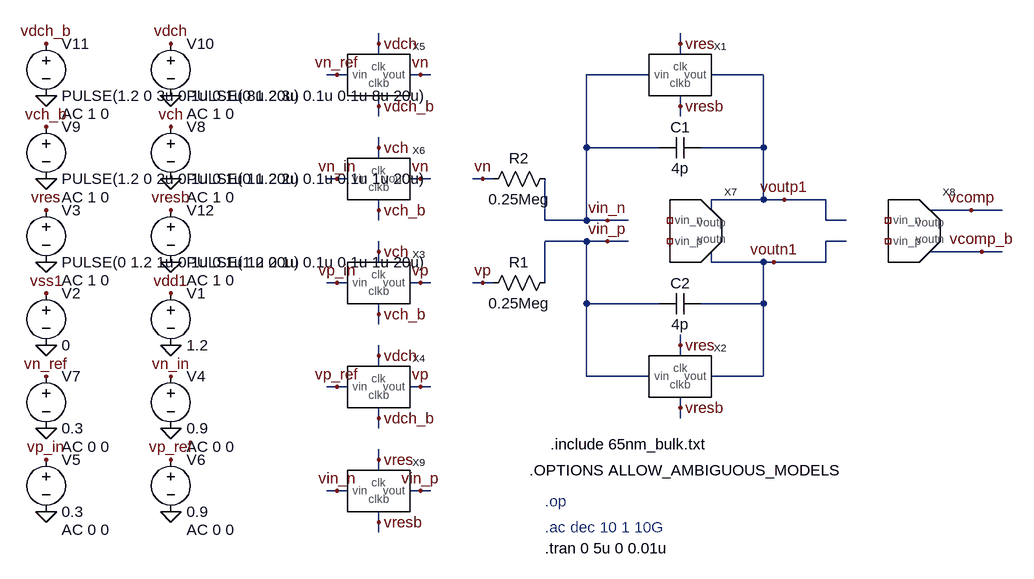
[diagram p0: schematic ADC_DS_CT_FAST.asc]
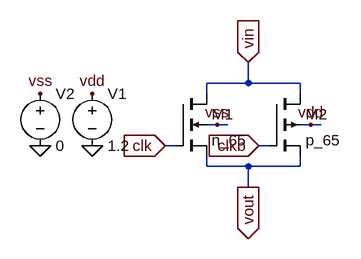
[diagram p1: sub-circuit tg_switch.asc]
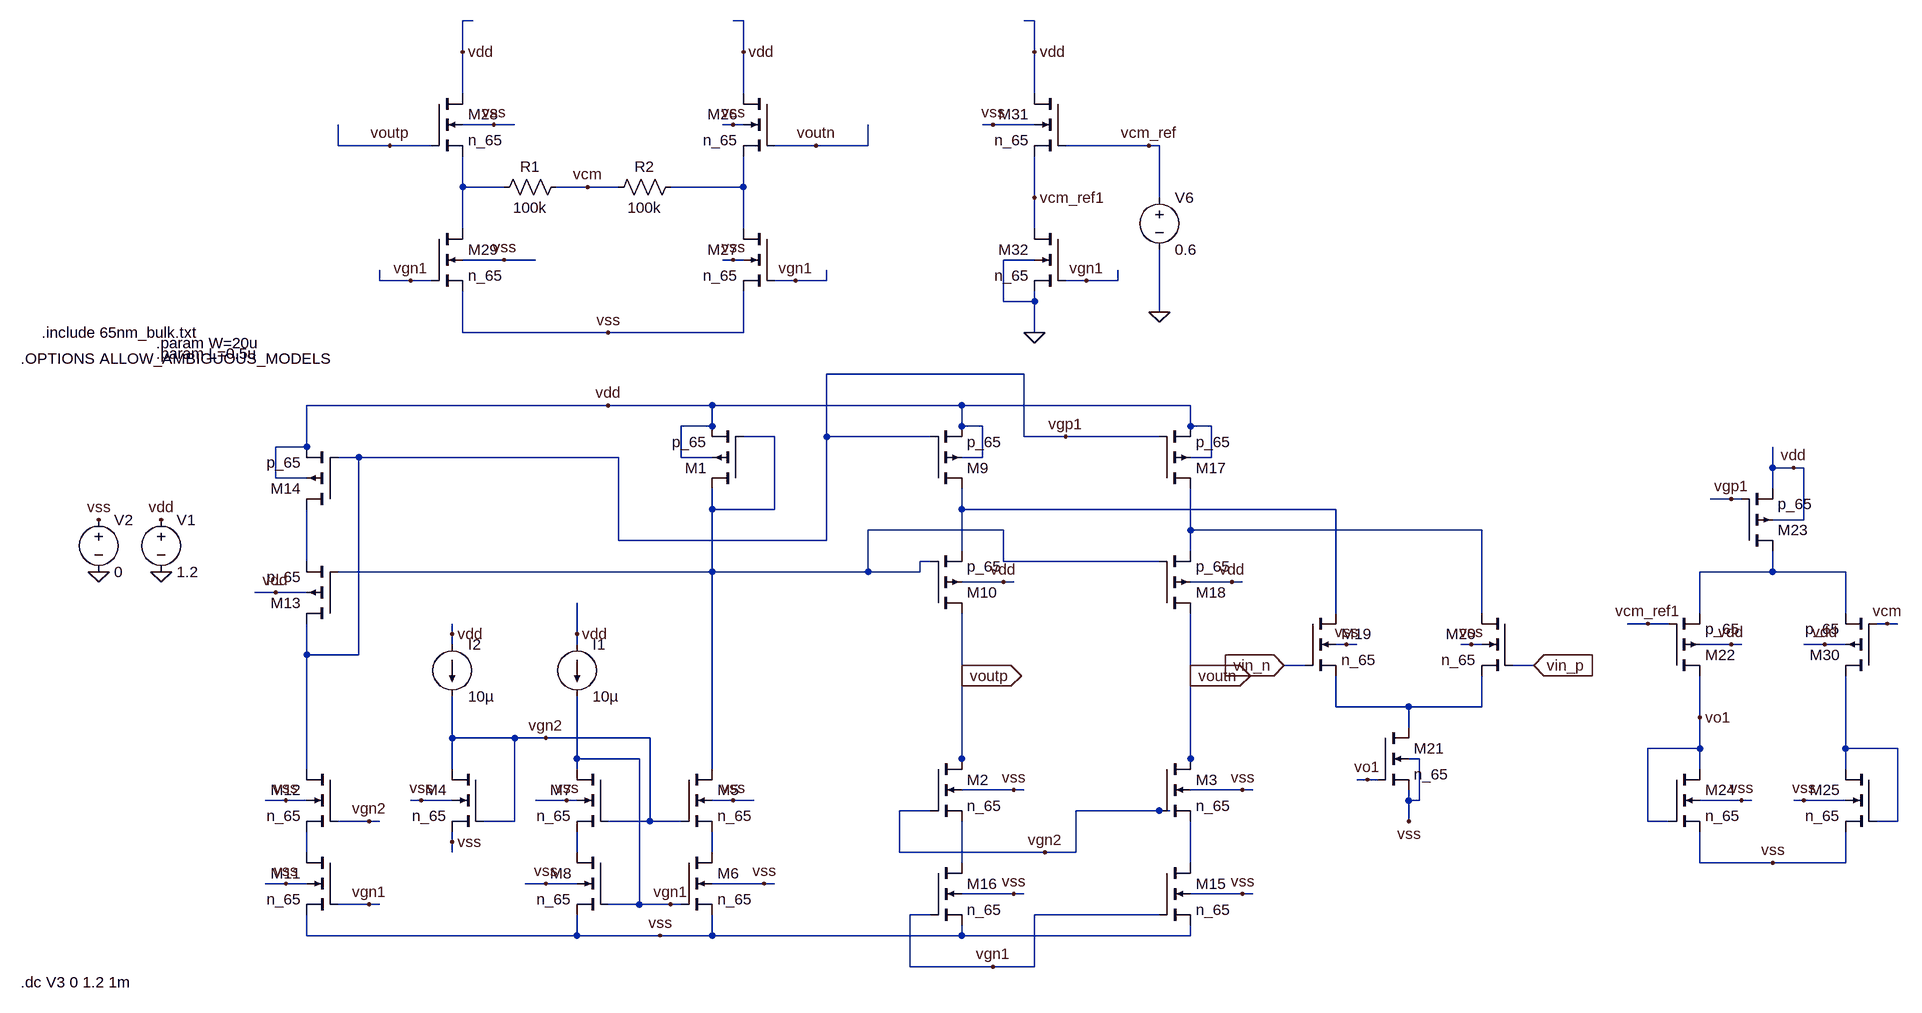
[diagram p2: sub-circuit fc_ota_small_input.asc]
ADC_DS_CT_FAST.asc, the LTspice schematic file:
Version 4.1
SHEET 1 1620 1140
WIRE 464 -176 464 -192
WIRE 928 -176 928 -192
WIRE 464 -160 464 -176
WIRE 928 -160 928 -176
WIRE 400 -128 384 -128
WIRE 416 -128 400 -128
WIRE 528 -128 512 -128
WIRE 544 -128 528 -128
WIRE 880 -128 784 -128
WIRE 1056 -128 976 -128
WIRE 464 -80 464 -96
WIRE 928 -80 928 -96
WIRE 464 -64 464 -80
WIRE 928 -64 928 -80
WIRE 464 -16 464 -32
WIRE 784 -16 784 -128
WIRE 896 -16 784 -16
WIRE 1056 -16 1056 -128
WIRE 1056 -16 960 -16
WIRE 464 0 464 -16
WIRE 400 32 384 32
WIRE 416 32 400 32
WIRE 528 32 512 32
WIRE 544 32 528 32
WIRE 624 32 608 32
WIRE 640 32 624 32
WIRE 1056 64 1056 -16
WIRE 1056 64 976 64
WIRE 1088 64 1056 64
WIRE 1152 64 1088 64
WIRE 464 80 464 64
WIRE 976 80 976 64
WIRE 1376 80 1312 80
WIRE 1424 80 1376 80
WIRE 464 96 464 80
WIRE 720 96 720 32
WIRE 784 96 784 -16
WIRE 784 96 720 96
WIRE 816 96 784 96
WIRE 848 96 816 96
WIRE 1152 96 1152 64
WIRE 1184 96 1152 96
WIRE 784 128 720 128
WIRE 816 128 784 128
WIRE 848 128 816 128
WIRE 1184 128 1152 128
WIRE 464 144 464 128
WIRE 1392 144 1312 144
WIRE 1424 144 1392 144
WIRE 464 160 464 144
WIRE 976 160 976 144
WIRE 1056 160 976 160
WIRE 1072 160 1056 160
WIRE 1152 160 1152 128
WIRE 1152 160 1072 160
WIRE 400 192 384 192
WIRE 416 192 400 192
WIRE 528 192 512 192
WIRE 544 192 528 192
WIRE 624 192 608 192
WIRE 640 192 624 192
WIRE 720 192 720 128
WIRE 784 224 784 128
WIRE 896 224 784 224
WIRE 1056 224 1056 160
WIRE 1056 224 960 224
WIRE 464 240 464 224
WIRE 464 256 464 240
WIRE 928 288 928 272
WIRE 464 304 464 288
WIRE 928 304 928 288
WIRE 464 320 464 304
WIRE 784 336 784 224
WIRE 880 336 784 336
WIRE 1056 336 1056 224
WIRE 1056 336 976 336
WIRE 400 352 384 352
WIRE 416 352 400 352
WIRE 528 352 512 352
WIRE 544 352 528 352
WIRE 928 384 928 368
WIRE 464 400 464 384
WIRE 928 400 928 384
WIRE 464 416 464 400
WIRE 464 464 464 448
WIRE 464 480 464 464
WIRE 400 512 384 512
WIRE 416 512 400 512
WIRE 528 512 512 512
WIRE 544 512 528 512
WIRE 464 560 464 544
WIRE 464 576 464 560
FLAG 144 288 0
FLAG 144 208 vdd1
FLAG -48 288 0
FLAG -48 208 vss1
FLAG 1088 64 voutp1
FLAG 1072 160 voutn1
FLAG -48 160 0
FLAG -48 80 vres
FLAG 928 -176 vres
FLAG 928 -80 vresb
FLAG 928 288 vres
FLAG 928 384 vresb
FLAG 144 416 0
FLAG -48 544 0
FLAG -48 464 vp_in
FLAG 144 336 vn_in
FLAG 624 32 vn
FLAG 624 192 vp
FLAG 464 144 vch
FLAG 464 240 vch_b
FLAG 464 304 vdch
FLAG 464 400 vdch_b
FLAG 528 352 vp
FLAG 528 192 vp
FLAG 144 544 0
FLAG 144 464 vp_ref
FLAG -48 416 0
FLAG -48 336 vn_ref
FLAG 464 -176 vdch
FLAG 464 -80 vdch_b
FLAG 528 -128 vn
FLAG 464 -16 vch
FLAG 464 80 vch_b
FLAG 528 32 vn
FLAG 400 32 vn_in
FLAG 400 -128 vn_ref
FLAG 400 192 vp_in
FLAG 400 352 vp_ref
FLAG 144 32 0
FLAG 144 -48 vch
FLAG -48 32 0
FLAG -48 -48 vch_b
FLAG 144 -96 0
FLAG 144 -176 vdch
FLAG -48 -96 0
FLAG -48 -176 vdch_b
FLAG 144 160 0
FLAG 144 80 vresb
FLAG 1376 80 vcomp
FLAG 1392 144 vcomp_b
FLAG 464 464 vres
FLAG 464 560 vresb
FLAG 816 96 vin_n
FLAG 400 512 vin_n
FLAG 528 512 vin_p
FLAG 816 128 vin_p
DATAFLAG 784 48 ""
DATAFLAG 784 192 ""
DATAFLAG 752 96 ""
DATAFLAG 752 128 ""
SYMBOL voltage 144 192 R0
WINDOW 123 0 0 Left 0
WINDOW 39 0 0 Left 0
SYMATTR InstName V1
SYMATTR Value 1.2
SYMBOL voltage -48 192 R0
WINDOW 123 0 0 Left 0
WINDOW 39 0 0 Left 0
SYMATTR InstName V2
SYMATTR Value 0
SYMBOL voltage -48 64 R0
WINDOW 123 24 124 Left 2
WINDOW 39 0 0 Left 0
SYMATTR Value2 AC 1 0
SYMATTR InstName V3
SYMATTR Value PULSE(0 1.2 1u 0.1u 0.1u 1u 20u)
SYMBOL cap 960 -32 R90
WINDOW 0 0 32 VBottom 2
WINDOW 3 32 32 VTop 2
SYMATTR InstName C1
SYMATTR Value 4p
SYMBOL cap 960 208 R90
WINDOW 0 0 32 VBottom 2
WINDOW 3 32 32 VTop 2
SYMATTR InstName C2
SYMATTR Value 4p
SYMBOL res 736 176 R90
WINDOW 0 0 56 VBottom 2
WINDOW 3 32 56 VTop 2
SYMATTR InstName R1
SYMATTR Value 0.25Meg
SYMBOL res 736 16 R90
WINDOW 0 0 56 VBottom 2
WINDOW 3 32 56 VTop 2
SYMATTR InstName R2
SYMATTR Value 0.25Meg
SYMBOL TG_Switch 928 -128 R0
SYMATTR InstName X1
SYMBOL TG_Switch 928 336 R0
SYMATTR InstName X2
SYMBOL voltage 144 320 R0
WINDOW 123 24 124 Left 2
WINDOW 39 0 0 Left 0
SYMATTR Value2 AC 0 0
SYMATTR InstName V4
SYMATTR Value 0.9
SYMBOL voltage -48 448 R0
WINDOW 123 24 124 Left 2
WINDOW 39 0 0 Left 0
SYMATTR Value2 AC 0 0
SYMATTR InstName V5
SYMATTR Value 0.3
SYMBOL TG_Switch 464 192 R0
SYMATTR InstName X3
SYMBOL TG_Switch 464 352 R0
SYMATTR InstName X4
SYMBOL voltage 144 448 R0
WINDOW 123 24 124 Left 2
WINDOW 39 0 0 Left 0
SYMATTR Value2 AC 0 0
SYMATTR InstName V6
SYMATTR Value 0.9
SYMBOL voltage -48 320 R0
WINDOW 123 24 124 Left 2
WINDOW 39 0 0 Left 0
SYMATTR Value2 AC 0 0
SYMATTR InstName V7
SYMATTR Value 0.3
SYMBOL TG_Switch 464 -128 R0
SYMATTR InstName X5
SYMBOL TG_Switch 464 32 R0
SYMATTR InstName X6
SYMBOL voltage 144 -64 R0
WINDOW 123 24 124 Left 2
WINDOW 39 0 0 Left 0
SYMATTR Value2 AC 1 0
SYMATTR InstName V8
SYMATTR Value PULSE(0 1.2 2u 0.1u 0.1u 1u 20u)
SYMBOL voltage 144 -192 R0
WINDOW 123 24 124 Left 2
WINDOW 39 0 0 Left 0
SYMATTR Value2 AC 1 0
SYMATTR InstName V10
SYMATTR Value PULSE(0 1.2 3u 0.1u 0.1u 8u 20u)
SYMBOL voltage -48 -192 R0
WINDOW 123 24 124 Left 2
WINDOW 39 0 0 Left 0
SYMATTR Value2 AC 1 0
SYMATTR InstName V11
SYMATTR Value PULSE(1.2 0 3u 0.1u 0.1u 8u 20u)
SYMBOL FC_OTA_small_input 944 112 R0
SYMATTR InstName X7
SYMBOL voltage 144 64 R0
WINDOW 123 24 124 Left 2
WINDOW 39 0 0 Left 0
SYMATTR Value2 AC 1 0
SYMATTR InstName V12
SYMATTR Value PULSE(1.2 0 1u 0.1u 0.1u 1u 20u)
SYMBOL voltage -48 -64 R0
WINDOW 123 24 124 Left 2
WINDOW 39 0 0 Left 0
SYMATTR Value2 AC 1 0
SYMATTR InstName V9
SYMATTR Value PULSE(1.2 0 2u 0.1u 0.1u 1u 20u)
SYMBOL FC_OTA_small_input 1280 112 R0
SYMATTR InstName X8
SYMBOL TG_Switch 464 512 R0
SYMATTR InstName X9
TEXT 728 440 Left 2 !.include 65nm_bulk.txt
TEXT 696 480 Left 2 !.OPTIONS ALLOW_AMBIGUOUS_MODELS
TEXT 720 528 Left 2 ;.op
TEXT 720 568 Left 2 ;.ac dec 10 1 10G
TEXT 720 600 Left 2 !.tran 0 5u 0 0.01u

tg_switch.asc, the sub-circuit schematic file:
Version 4.1
SHEET 1 880 680
WIRE 112 0 112 -32
WIRE 112 0 48 0
WIRE 192 0 112 0
WIRE 48 16 48 0
WIRE 192 16 192 0
WIRE 64 64 48 64
WIRE 80 64 64 64
WIRE 208 64 192 64
WIRE 224 64 208 64
WIRE 0 96 -16 96
WIRE 144 96 128 96
WIRE 48 128 48 112
WIRE 112 128 48 128
WIRE 192 128 192 112
WIRE 192 128 112 128
WIRE 112 160 112 128
FLAG 64 64 vss
FLAG 208 64 vdd
FLAG -16 96 clk
IOPIN -16 96 In
FLAG 128 96 clkb
IOPIN 128 96 In
FLAG 112 -32 vin
IOPIN 112 -32 In
FLAG -128 96 0
FLAG -128 16 vdd
FLAG -208 96 0
FLAG -208 16 vss
FLAG 112 160 vout
IOPIN 112 160 Out
SYMBOL nmos4 0 16 R0
SYMATTR InstName M1
SYMATTR Value n_65
SYMATTR Value2 l=1u w=1u
SYMBOL pmos4 144 16 R0
SYMATTR InstName M2
SYMATTR Value p_65
SYMATTR Value2 l=1u w=2u
SYMBOL voltage -128 0 R0
WINDOW 123 0 0 Left 0
WINDOW 39 0 0 Left 0
SYMATTR InstName V1
SYMATTR Value 1.2
SYMBOL voltage -208 0 R0
WINDOW 123 0 0 Left 0
WINDOW 39 0 0 Left 0
SYMATTR InstName V2
SYMATTR Value 0

fc_ota_small_input.asc, the sub-circuit schematic file:
Version 4.1
SHEET 1 1988 876
WIRE -752 -816 -768 -816
WIRE -336 -816 -352 -816
WIRE 112 -816 96 -816
WIRE -768 -768 -768 -816
WIRE -336 -768 -336 -816
WIRE 112 -768 112 -816
WIRE -768 -704 -768 -768
WIRE -336 -704 -336 -768
WIRE 112 -704 112 -768
WIRE -720 -656 -768 -656
WIRE -688 -656 -720 -656
WIRE -352 -656 -368 -656
WIRE -336 -656 -352 -656
WIRE 48 -656 32 -656
WIRE 112 -656 48 -656
WIRE -960 -624 -960 -656
WIRE -880 -624 -960 -624
WIRE -816 -624 -880 -624
WIRE -224 -624 -288 -624
WIRE -144 -624 -144 -656
WIRE -144 -624 -224 -624
WIRE 288 -624 160 -624
WIRE 304 -624 288 -624
WIRE -768 -560 -768 -608
WIRE -704 -560 -768 -560
WIRE -576 -560 -624 -560
WIRE -528 -560 -576 -560
WIRE -336 -560 -336 -608
WIRE -336 -560 -448 -560
WIRE 112 -544 112 -608
WIRE 304 -544 304 -624
WIRE -768 -496 -768 -560
WIRE -336 -496 -336 -560
WIRE 112 -496 112 -544
WIRE -704 -448 -768 -448
WIRE -656 -448 -704 -448
WIRE -352 -448 -368 -448
WIRE -336 -448 -352 -448
WIRE 112 -448 64 -448
WIRE -896 -416 -896 -432
WIRE -848 -416 -896 -416
WIRE -816 -416 -848 -416
WIRE -256 -416 -288 -416
WIRE -208 -416 -208 -432
WIRE -208 -416 -256 -416
WIRE 192 -416 160 -416
WIRE 240 -416 240 -432
WIRE 240 -416 192 -416
WIRE 64 -384 64 -448
WIRE 112 -384 112 -400
WIRE 112 -384 64 -384
WIRE 304 -368 304 -464
WIRE -768 -336 -768 -400
WIRE -544 -336 -768 -336
WIRE -336 -336 -336 -400
WIRE -336 -336 -544 -336
WIRE 112 -336 112 -384
WIRE 96 -272 -208 -272
WIRE -544 -224 -1008 -224
WIRE -384 -224 -544 -224
WIRE 0 -224 -384 -224
WIRE 352 -224 0 -224
WIRE -384 -192 -384 -224
WIRE -384 -192 -432 -192
WIRE 0 -192 0 -224
WIRE 32 -192 0 -192
WIRE 352 -192 352 -224
WIRE 384 -192 352 -192
WIRE -288 -176 -336 -176
WIRE -208 -176 -208 -272
WIRE -48 -176 -208 -176
WIRE 96 -176 96 -272
WIRE 160 -176 96 -176
WIRE 304 -176 160 -176
WIRE -1008 -160 -1008 -224
WIRE -1008 -160 -1056 -160
WIRE -1008 -144 -1008 -160
WIRE -928 -144 -960 -144
WIRE -528 -144 -928 -144
WIRE -432 -144 -432 -192
WIRE -384 -144 -432 -144
WIRE 32 -144 32 -192
WIRE 32 -144 0 -144
WIRE 384 -144 384 -192
WIRE 384 -144 352 -144
WIRE 1248 -128 1248 -160
WIRE 1280 -128 1248 -128
WIRE 1296 -128 1280 -128
WIRE -1056 -112 -1056 -160
WIRE -1008 -112 -1056 -112
WIRE 1248 -96 1248 -128
WIRE 1184 -80 1152 -80
WIRE 1200 -80 1184 -80
WIRE -384 -64 -384 -96
WIRE -288 -64 -288 -176
WIRE -288 -64 -384 -64
WIRE 0 -64 0 -96
WIRE 576 -64 0 -64
WIRE 1296 -48 1296 -128
WIRE 1296 -48 1248 -48
WIRE 64 -32 -144 -32
WIRE 352 -32 352 -96
WIRE 800 -32 352 -32
WIRE -528 -16 -528 -144
WIRE -208 -16 -208 -176
WIRE -208 -16 -528 -16
WIRE 0 0 0 -64
WIRE 352 0 352 -32
WIRE -1008 16 -1008 -64
WIRE -48 16 -64 16
WIRE 64 16 64 -32
WIRE 304 16 64 16
WIRE -384 32 -384 -64
WIRE -384 32 -960 32
WIRE -144 32 -144 -32
WIRE -144 32 -384 32
WIRE -64 32 -64 16
WIRE -64 32 -144 32
WIRE 1248 32 1248 0
WIRE 1248 32 1136 32
WIRE 1360 32 1248 32
WIRE 64 48 0 48
WIRE 80 48 64 48
WIRE 416 48 352 48
WIRE 432 48 416 48
WIRE -1056 64 -1088 64
WIRE -1008 64 -1056 64
WIRE 576 96 576 -64
WIRE 800 96 800 -32
WIRE 1136 96 1136 32
WIRE 1360 96 1360 32
WIRE 1056 112 1024 112
WIRE 1088 112 1056 112
WIRE 1424 112 1408 112
WIRE 1440 112 1424 112
WIRE -784 128 -784 112
WIRE -592 128 -592 80
WIRE -784 144 -784 128
WIRE -592 144 -592 128
WIRE 592 144 576 144
WIRE 608 144 592 144
WIRE 784 144 768 144
WIRE 800 144 784 144
WIRE 1184 144 1136 144
WIRE 1200 144 1184 144
WIRE 1328 144 1296 144
WIRE 1360 144 1328 144
WIRE -1008 160 -1008 112
WIRE -928 160 -928 -144
WIRE -928 160 -1008 160
WIRE 528 176 496 176
WIRE 880 176 848 176
WIRE 0 192 0 96
WIRE 352 192 352 96
WIRE 576 240 576 192
WIRE 688 240 576 240
WIRE 800 240 800 192
WIRE 800 240 688 240
WIRE 1136 256 1136 192
WIRE 688 272 688 240
WIRE -784 288 -784 224
WIRE -688 288 -784 288
WIRE -640 288 -688 288
WIRE -480 288 -640 288
WIRE 1136 304 1136 256
WIRE 1136 304 1056 304
WIRE 1360 304 1360 192
WIRE 1440 304 1360 304
WIRE -592 320 -592 224
WIRE -496 320 -592 320
WIRE 0 320 0 192
WIRE 352 320 352 192
WIRE 704 320 688 320
WIRE -1008 336 -1008 160
WIRE -784 336 -784 288
WIRE -592 336 -592 320
WIRE -384 336 -384 32
WIRE 0 336 0 320
WIRE 352 336 352 320
WIRE 1136 336 1136 304
WIRE 1360 336 1360 304
WIRE 624 352 608 352
WIRE 640 352 624 352
WIRE 80 368 0 368
WIRE 96 368 80 368
WIRE 432 368 352 368
WIRE 448 368 432 368
WIRE -1040 384 -1072 384
WIRE -1008 384 -1040 384
WIRE -832 384 -848 384
WIRE -784 384 -832 384
WIRE -608 384 -656 384
WIRE -592 384 -608 384
WIRE -352 384 -384 384
WIRE -320 384 -352 384
WIRE 688 384 688 368
WIRE 704 384 704 320
WIRE 704 384 688 384
WIRE 1200 384 1136 384
WIRE 1216 384 1200 384
WIRE 1296 384 1280 384
WIRE 1360 384 1296 384
WIRE -48 400 -96 400
WIRE 304 400 176 400
WIRE 320 400 304 400
WIRE -912 416 -960 416
WIRE -896 416 -912 416
WIRE -688 416 -688 288
WIRE -688 416 -736 416
WIRE -480 416 -480 288
WIRE -480 416 -544 416
WIRE -432 416 -480 416
WIRE 688 416 688 384
WIRE 1056 416 1056 304
WIRE 1088 416 1056 416
WIRE 1440 416 1440 304
WIRE 1440 416 1408 416
WIRE -784 448 -784 432
WIRE -1008 464 -1008 432
WIRE -784 464 -784 448
WIRE -592 464 -592 432
WIRE -384 464 -384 432
WIRE -96 464 -96 400
WIRE 128 464 -96 464
WIRE 176 464 176 400
WIRE 176 464 128 464
WIRE 0 480 0 416
WIRE 352 480 352 416
WIRE 1136 480 1136 432
WIRE 1248 480 1136 480
WIRE 1360 480 1360 432
WIRE 1360 480 1248 480
WIRE -1040 512 -1072 512
WIRE -1008 512 -1040 512
WIRE -640 512 -672 512
WIRE -592 512 -640 512
WIRE -304 512 -384 512
WIRE -288 512 -304 512
WIRE 80 528 0 528
WIRE 96 528 80 528
WIRE 432 528 352 528
WIRE 448 528 432 528
WIRE -912 544 -960 544
WIRE -896 544 -912 544
WIRE -496 544 -496 320
WIRE -496 544 -544 544
WIRE -448 544 -496 544
WIRE -432 544 -448 544
WIRE -48 560 -80 560
WIRE 304 560 112 560
WIRE -1008 592 -1008 560
WIRE -592 592 -592 560
WIRE -592 592 -1008 592
WIRE -464 592 -592 592
WIRE -384 592 -384 560
WIRE -384 592 -464 592
WIRE 0 592 0 576
WIRE 0 592 -384 592
WIRE 352 592 352 576
WIRE 352 592 0 592
WIRE -80 640 -80 560
WIRE 48 640 -80 640
WIRE 112 640 112 560
WIRE 112 640 48 640
FLAG -592 128 vdd
FLAG 80 368 vss
FLAG 80 528 vss
FLAG -352 384 vss
FLAG -464 592 vss
FLAG -784 128 vdd
FLAG -784 448 vss
FLAG -608 384 vss
FLAG 64 48 vdd
FLAG -1040 384 vss
FLAG -912 544 vgn1
FLAG -912 416 vgn2
FLAG -544 -224 vdd
FLAG -1232 32 0
FLAG -1232 -48 vdd
FLAG -1328 32 0
FLAG -1328 -48 vss
FLAG 0 192 voutp
IOPIN 0 192 Out
FLAG 432 368 vss
FLAG 432 528 vss
FLAG 416 48 vdd
FLAG 352 192 voutn
IOPIN 352 192 Out
FLAG 592 144 vss
FLAG 784 144 vss
FLAG 688 416 vss
FLAG 1248 480 vss
FLAG 1200 384 vss
FLAG 1296 384 vss
FLAG 1280 -128 vdd
FLAG 1184 144 vdd
FLAG 880 176 vin_p
IOPIN 880 176 In
FLAG 496 176 vin_n
IOPIN 496 176 In
FLAG 160 -176 vgp1
FLAG -640 288 vgn2
FLAG 48 640 vgn1
FLAG 128 464 vgn2
FLAG -336 -768 vdd
FLAG -256 -416 vgn1
FLAG -224 -624 voutn
FLAG -768 -768 vdd
FLAG -848 -416 vgn1
FLAG -880 -624 voutp
FLAG -544 -336 vss
FLAG -576 -560 vcm
FLAG 1328 144 vdd
FLAG 1424 112 vcm
FLAG 1184 -80 vgp1
FLAG -448 544 vgn1
FLAG 112 -768 vdd
FLAG 192 -416 vgn1
FLAG 304 -368 0
FLAG 288 -624 vcm_ref
FLAG 112 -544 vcm_ref1
FLAG 1056 112 vcm_ref1
FLAG 112 -336 0
FLAG 1136 256 vo1
FLAG 624 352 vo1
FLAG -1056 64 vdd
FLAG -304 512 vss
FLAG -640 512 vss
FLAG -832 384 vss
FLAG -1040 512 vss
FLAG -704 -448 vss
FLAG -352 -448 vss
FLAG -720 -656 vss
FLAG -352 -656 vss
FLAG 48 -656 vss
DATAFLAG -512 288 ""
DATAFLAG -144 32 ""
DATAFLAG 112 -192 ""
DATAFLAG 352 -208 ""
DATAFLAG 1184 32 ""
DATAFLAG 1136 240 ""
DATAFLAG 1360 256 ""
DATAFLAG 0 144 ""
DATAFLAG 352 144 ""
DATAFLAG 688 -32 ""
DATAFLAG 80 -64 ""
DATAFLAG 352 464 ""
DATAFLAG 0 464 ""
DATAFLAG 688 400 ""
DATAFLAG -32 560 ""
DATAFLAG 208 16 ""
DATAFLAG 192 544 ""
DATAFLAG -768 -592 ""
DATAFLAG -336 -576 ""
DATAFLAG -944 -624 ""
DATAFLAG -144 -640 ""
DATAFLAG -944 416 ""
DATAFLAG -944 544 ""
DATAFLAG -528 416 ""
DATAFLAG -528 544 ""
DATAFLAG -640 -144 ""
DATAFLAG -688 32 ""
DATAFLAG -1008 -48 ""
DATAFLAG 224 -640 ""
DATAFLAG 576 -16 ""
DATAFLAG 688 256 ""
DATAFLAG 352 144 ""
SYMBOL pmos4 -336 -96 R180
SYMATTR InstName M1
SYMATTR Value p_65
SYMATTR Value2 l={L} w=0.25*{W}
SYMBOL nmos4 -48 320 R0
SYMATTR InstName M2
SYMATTR Value n_65
SYMATTR Value2 l={L} w={W}
SYMBOL current -592 144 R0
WINDOW 123 0 0 Left 0
WINDOW 39 0 0 Left 0
SYMATTR InstName I1
SYMATTR Value 10µ
SYMBOL current -784 144 R0
WINDOW 123 0 0 Left 0
WINDOW 39 0 0 Left 0
SYMATTR InstName I2
SYMATTR Value 10µ
SYMBOL pmos4 -48 -96 M180
SYMATTR InstName M9
SYMATTR Value p_65
SYMATTR Value2 l={L} w=2*{W}
SYMBOL pmos4 -48 96 M180
SYMATTR InstName M10
SYMATTR Value p_65
SYMATTR Value2 l={L} w={W}
SYMBOL voltage -1232 -64 R0
WINDOW 123 0 0 Left 0
WINDOW 39 0 0 Left 0
SYMATTR InstName V1
SYMATTR Value 1.2
SYMBOL voltage -1328 -64 R0
WINDOW 123 0 0 Left 0
WINDOW 39 0 0 Left 0
SYMATTR InstName V2
SYMATTR Value 0
SYMBOL pmos4 304 -96 M180
SYMATTR InstName M17
SYMATTR Value p_65
SYMATTR Value2 l={L} w=2*{W}
SYMBOL nmos4 528 96 R0
SYMATTR InstName M19
SYMATTR Value n_65
SYMATTR Value2 l=0.5u w=60u
SYMBOL nmos4 848 96 M0
SYMATTR InstName M20
SYMATTR Value n_65
SYMATTR Value2 l=0.5u w=60u
SYMBOL nmos4 640 272 R0
SYMATTR InstName M21
SYMATTR Value n_65
SYMATTR Value2 l={L} w=2*{W}
SYMBOL pmos4 1088 192 M180
SYMATTR InstName M22
SYMATTR Value p_65
SYMATTR Value2 l=65n w=90u
SYMBOL nmos4 -288 -704 M0
SYMATTR InstName M26
SYMATTR Value n_65
SYMATTR Value2 l=65n w=20u
SYMBOL nmos4 -288 -496 M0
SYMATTR InstName M27
SYMATTR Value n_65
SYMATTR Value2 l=200n w=20u
SYMBOL nmos4 -816 -704 R0
SYMATTR InstName M28
SYMATTR Value n_65
SYMATTR Value2 l=65n w=20u
SYMBOL nmos4 -816 -496 R0
SYMATTR InstName M29
SYMATTR Value n_65
SYMATTR Value2 l=200n w=20u
SYMBOL res -608 -576 R90
WINDOW 0 0 56 VBottom 2
WINDOW 3 32 56 VTop 2
SYMATTR InstName R1
SYMATTR Value 100k
SYMATTR SpiceLine tol=1 pwr=0.1
SYMBOL res -432 -576 R90
WINDOW 0 0 56 VBottom 2
WINDOW 3 32 56 VTop 2
SYMATTR InstName R2
SYMATTR Value 100k
SYMATTR SpiceLine tol=1 pwr=0.1
SYMBOL pmos4 1408 192 R180
SYMATTR InstName M30
SYMATTR Value p_65
SYMATTR Value2 l=65n w=90u
SYMBOL nmos4 160 -704 M0
SYMATTR InstName M31
SYMATTR Value n_65
SYMATTR Value2 l=65n w=20u
SYMBOL nmos4 160 -496 M0
SYMATTR InstName M32
SYMATTR Value n_65
SYMATTR Value2 l=200n w=20u
SYMBOL voltage 304 -560 R0
WINDOW 123 0 0 Left 0
WINDOW 39 0 0 Left 0
SYMATTR InstName V6
SYMATTR Value 0.6
SYMBOL pmos4 304 96 M180
SYMATTR InstName M18
SYMATTR Value p_65
SYMATTR Value2 l={L} w={W}
SYMBOL nmos4 304 320 R0
SYMATTR InstName M3
SYMATTR Value n_65
SYMATTR Value2 l={L} w={W}
SYMBOL nmos4 304 480 R0
SYMATTR InstName M15
SYMATTR Value n_65
SYMATTR Value2 l={L} w={W}
SYMBOL nmos4 -48 480 R0
SYMATTR InstName M16
SYMATTR Value n_65
SYMATTR Value2 l={L} w={W}
SYMBOL nmos4 -432 336 R0
SYMATTR InstName M5
SYMATTR Value n_65
SYMATTR Value2 l={L} w={W}
SYMBOL nmos4 -432 464 R0
SYMATTR InstName M6
SYMATTR Value n_65
SYMATTR Value2 l={L} w={W}
SYMBOL nmos4 -736 336 M0
SYMATTR InstName M4
SYMATTR Value n_65
SYMATTR Value2 l={L} w=0.25*{W}
SYMBOL nmos4 -544 336 M0
SYMATTR InstName M7
SYMATTR Value n_65
SYMATTR Value2 l={L} w={W}
SYMBOL nmos4 -544 464 M0
SYMATTR InstName M8
SYMATTR Value n_65
SYMATTR Value2 l={L} w={W}
SYMBOL nmos4 -960 464 M0
SYMATTR InstName M11
SYMATTR Value n_65
SYMATTR Value2 l={L} w={W}
SYMBOL nmos4 -960 336 M0
SYMATTR InstName M12
SYMATTR Value n_65
SYMATTR Value2 l={L} w={W}
SYMBOL pmos4 -960 112 R180
SYMATTR InstName M13
SYMATTR Value p_65
SYMATTR Value2 l={L} w={W}
SYMBOL pmos4 -960 -64 R180
SYMATTR InstName M14
SYMATTR Value p_65
SYMATTR Value2 l={L} w={W}
SYMBOL pmos4 1200 0 M180
SYMATTR InstName M23
SYMATTR Value p_65
SYMATTR Value2 l={L} w=2*{W}
SYMBOL nmos4 1088 336 R0
SYMATTR InstName M24
SYMATTR Value n_65
SYMATTR Value2 l={L} w={W}
SYMBOL nmos4 1408 336 M0
SYMATTR InstName M25
SYMATTR Value n_65
SYMATTR Value2 l={L} w={W}
TEXT -1416 -336 Left 2 !.include 65nm_bulk.txt
TEXT -1448 -296 Left 2 !.OPTIONS ALLOW_AMBIGUOUS_MODELS
TEXT -1240 -320 Left 2 !.param W=20u
TEXT -1240 -304 Left 2 !.param L=0.5u
TEXT -1448 664 Left 2 !.dc V3 0 1.2 1m

The netlist it stands for:
* ADC_DS_CT_FAST.asc
V1 vdd1 0 1.2
V2 vss1 0 0
V3 vres 0 PULSE(0 1.2 1u 0.1u 0.1u 1u 20u) AC 1 0
C1 voutp1 vin_n 4p
C2 voutn1 vin_p 4p
R1 vin_p vp 0.25Meg
R2 vin_n vn 0.25Meg
X§X1 vres vresb vin_n voutp1 tg_switch
X§X2 vres vresb vin_p voutn1 tg_switch
V4 vn_in 0 0.9 AC 0 0
V5 vp_in 0 0.3 AC 0 0
X§X3 vch vch_b vp_in vp tg_switch
X§X4 vdch vdch_b vp_ref vp tg_switch
V6 vp_ref 0 0.9 AC 0 0
V7 vn_ref 0 0.3 AC 0 0
X§X5 vdch vdch_b vn_ref vn tg_switch
X§X6 vch vch_b vn_in vn tg_switch
V8 vch 0 PULSE(0 1.2 2u 0.1u 0.1u 1u 20u) AC 1 0
V10 vdch 0 PULSE(0 1.2 3u 0.1u 0.1u 8u 20u) AC 1 0
V11 vdch_b 0 PULSE(1.2 0 3u 0.1u 0.1u 8u 20u) AC 1 0
X§X7 NC_01 NC_02 voutp1 voutn1 fc_ota_small_input
V12 vresb 0 PULSE(1.2 0 1u 0.1u 0.1u 1u 20u) AC 1 0
V9 vch_b 0 PULSE(1.2 0 2u 0.1u 0.1u 1u 20u) AC 1 0
X§X8 NC_03 NC_04 vcomp vcomp_b fc_ota_small_input
X§X9 vres vresb vin_n vin_p tg_switch

* block symbol definitions
.subckt tg_switch clk clkb vin vout
M1 vin clk vout vss n_65 l=1u w=1u
M2 vin clkb vout vdd p_65 l=1u w=2u
V1 vdd 0 1.2
V2 vss 0 0
.ends tg_switch

.subckt fc_ota_small_input vin_n vin_p voutp voutn
M1 N003 N003 vdd vdd p_65 l={L} w=0.25*{W}
M2 voutp vgn2 N013 vss n_65 l={L} w={W}
I1 vdd vgn1 10µ
I2 vdd vgn2 10µ
M9 N004 vgp1 vdd vdd p_65 l={L} w=2*{W}
M10 voutp N003 N004 vdd p_65 l={L} w={W}
V1 vdd 0 1.2
V2 vss 0 0
M17 N005 vgp1 vdd vdd p_65 l={L} w=2*{W}
M19 N004 vin_n N008 vss n_65 l=0.5u w=60u
M20 N005 vin_p N008 vss n_65 l=0.5u w=60u
M21 N008 vo1 vss vss n_65 l={L} w=2*{W}
M22 vo1 vcm_ref1 N007 vdd p_65 l=65n w=90u
M26 vdd voutn N002 vss n_65 l=65n w=20u
M27 N002 vgn1 vss vss n_65 l=200n w=20u
M28 vdd voutp N001 vss n_65 l=65n w=20u
M29 N001 vgn1 vss vss n_65 l=200n w=20u
R1 vcm N001 100k tol=1 pwr=0.1
R2 N002 vcm 100k tol=1 pwr=0.1
M30 N009 vcm N007 vdd p_65 l=65n w=90u
M31 vdd vcm_ref vcm_ref1 vss n_65 l=65n w=20u
M32 vcm_ref1 vgn1 0 0 n_65 l=200n w=20u
V6 vcm_ref 0 0.6
M18 voutn N003 N005 vdd p_65 l={L} w={W}
M3 voutn vgn2 N014 vss n_65 l={L} w={W}
M15 N014 vgn1 vss vss n_65 l={L} w={W}
M16 N013 vgn1 vss vss n_65 l={L} w={W}
M5 N003 vgn2 N012 vss n_65 l={L} w={W}
M6 N012 vgn1 vss vss n_65 l={L} w={W}
M4 vgn2 vgn2 vss vss n_65 l={L} w=0.25*{W}
M7 vgn1 vgn2 N011 vss n_65 l={L} w={W}
M8 N011 vgn1 vss vss n_65 l={L} w={W}
M11 N010 vgn1 vss vss n_65 l={L} w={W}
M12 vgp1 vgn2 N010 vss n_65 l={L} w={W}
M13 vgp1 N003 N006 vdd p_65 l={L} w={W}
M14 N006 vgp1 vdd vdd p_65 l={L} w={W}
M23 N007 vgp1 vdd vdd p_65 l={L} w=2*{W}
M24 vo1 vo1 vss vss n_65 l={L} w={W}
M25 N009 N009 vss vss n_65 l={L} w={W}
.include 65nm_bulk.txt
.OPTIONS ALLOW_AMBIGUOUS_MODELS
.param W=20u
.param L=0.5u
.dc V3 0 1.2 1m
.ends fc_ota_small_input

.model NMOS NMOS
.model PMOS PMOS
.lib standard.mos
.include 65nm_bulk.txt
.OPTIONS ALLOW_AMBIGUOUS_MODELS
* .op
* .ac dec 10 1 10G
.tran 0 5u 0 0.01u
.backanno
.end